# Altium schematic sheet Motor.SchDoc
size A4; SheetNumber: 5; SheetTotal: 12
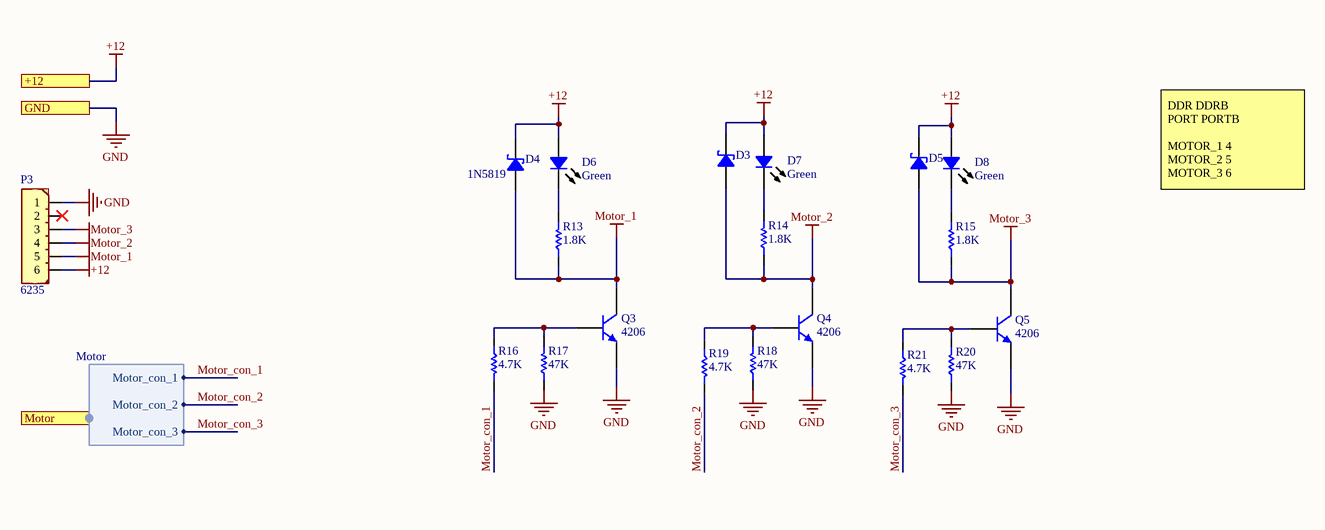
[diagram p0: Motor.SchDoc]

## Parts
D3  1N5819  [430X270D]  (value not drawn)
D4  1N5819  [430X270D]
D5  1N5819  [430X270D]  (value not drawn)
D6  Green  [LED 0805/2012 GREEN]
D7  Green  [LED 0805/2012 GREEN]
D8  Green  [LED 0805/2012 GREEN]
P3  Inflow: 6235  [645006114822]  (hidden comment: 6'Pin)
Q3  Inflow: 4206  [TO-220 AB]  (hidden comment: NPN)
Q4  Inflow: 4206  [TO-220 AB]  (hidden comment: NPN)
Q5  Inflow: 4206  [TO-220 AB]  (hidden comment: NPN)
R13  1.8K  [RES 0805 (2012X06L)]
R14  1.8K  [RES 0805 (2012X06L)]
R15  1.8K  [RES 0805 (2012X06L)]
R16  4.7K  [RES 1206 (3216X08L)]
R17  47K  [RES 1206 (3216X08L)]
R18  47K  [RES 1206 (3216X08L)]
R19  4.7K  [RES 1206 (3216X08L)]
R20  47K  [RES 1206 (3216X08L)]
R21  4.7K  [RES 1206 (3216X08L)]

## Ports
+12, GND, Motor (harness Motor)

## Harnesses
Motor: Motor_con_1, Motor_con_2, Motor_con_3

## Nets
+12: D3.2 D4.2 D5.2 D6.1 D7.1 D8.1 P3.6 ; port +12
GND: P3.1 Q3.3(E) Q4.3(E) Q5.3(E) R17.1 R18.1 R20.1 ; port GND
Motor_1: D4.1 P3.5 Q3.2(C) R13.1
Motor_2: D3.1 P3.4 Q4.2(C) R14.1
Motor_3: D5.1 P3.3 Q5.2(C) R15.1
Motor_con_1: R16.2 ; port Motor.Motor_con_1
Motor_con_2: R19.2 ; port Motor.Motor_con_2
Motor_con_3: R21.2 ; port Motor.Motor_con_3
NetD6_2: D6.2 R13.2
NetD7_2: D7.2 R14.2
NetD8_2: D8.2 R15.2
NetQ3_1: Q3.1(B) R16.1 R17.2
NetQ4_1: Q4.1(B) R18.2 R19.1
NetQ5_1: Q5.1(B) R20.2 R21.1

Not connected (* = marked no-connect by the designer): P3 2*

## Notes on the sheet
- DDR DDRB
  PORT PORTB
  MOTOR_1 4
  MOTOR_2 5
  MOTOR_3 6

## Library data of the parts
D3-D5 = Semi_Diod_Sch_1N5819_SMD: Schottky Rectifiers; Rating: Rating?; Validation: Valid; Inflow: inflow?; Package: SMA; Type: Schottky; Value: 1N5819
D6-D8 = Semi_LED_SMD: LED; Inflow: inflow?; Rating: Rating?; Validation: Valid; Package: Package?; Type: LED; Value: Green
P3 = Con_Power_6_PC_V: 6'Pin Power Connector; Rating: Rating?; Validation: Valid; Value: 6'Pin; Package: Package?; Type: Type?
Q3-Q5 = Semi_BJT_TIP41C: NPN Power transistor; Rating: Rating?; Type: Type?; Validation: NT; Value: NPN; Package: Package?
R13-R15 = Res_SMD_0805: Resistor; Inflow: inflow?; Rating: 0.125W; Validation: Valid; Package: 0805; Type: 10%; Value: 1.8K
R16-R21 = Res_SMD_1206: Resistor; Inflow: inflow?; Rating: 0.25W; Validation: Valid; Package: 1206; Type: 10%
  R16 R19 R21: Value: 4.7K
  R17 R18 R20: Value: 47K